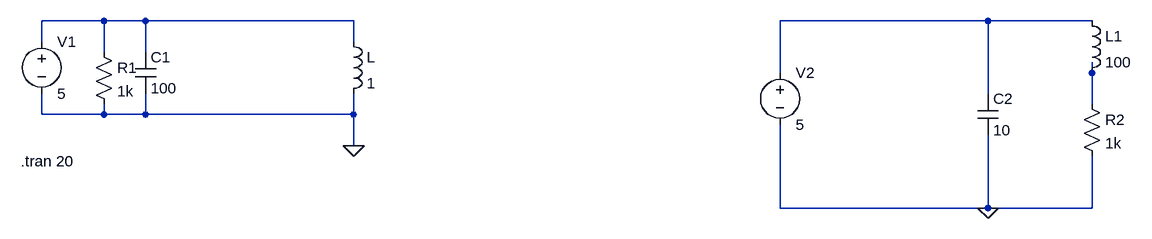
[diagram p0: schematic RCL.asc]
RCL.asc, the LTspice schematic file:
Version 4
SHEET 1 1540 680
WIRE -48 64 -144 64
WIRE 16 64 -48 64
WIRE 336 64 16 64
WIRE 1312 64 992 64
WIRE 1472 64 1312 64
WIRE -144 96 -144 64
WIRE 336 96 336 64
WIRE -48 112 -48 64
WIRE 16 112 16 64
WIRE 992 144 992 64
WIRE 1472 144 1472 128
WIRE 1312 176 1312 64
WIRE 1472 192 1472 144
WIRE -144 208 -144 176
WIRE -48 208 -48 192
WIRE -48 208 -144 208
WIRE 16 208 16 176
WIRE 16 208 -48 208
WIRE 336 208 336 176
WIRE 336 208 16 208
WIRE 336 256 336 208
WIRE 992 352 992 224
WIRE 1312 352 1312 240
WIRE 1312 352 992 352
WIRE 1472 352 1472 272
WIRE 1472 352 1312 352
FLAG 336 256 0
FLAG 1312 352 0
SYMBOL cap 0 112 R0
SYMATTR InstName C1
SYMATTR Value 100
SYMBOL ind 320 80 R0
SYMATTR InstName L
SYMATTR Value 1
SYMBOL res -64 96 R0
SYMATTR InstName R1
SYMATTR Value 1k
SYMBOL voltage -144 80 R0
WINDOW 123 0 0 Left 0
WINDOW 39 0 0 Left 0
SYMATTR InstName V1
SYMATTR Value 5
SYMBOL res 1456 176 R0
SYMATTR InstName R2
SYMATTR Value 1k
SYMBOL voltage 992 128 R0
WINDOW 123 0 0 Left 0
WINDOW 39 0 0 Left 0
SYMATTR InstName V2
SYMATTR Value 5
SYMBOL ind 1456 48 R0
SYMATTR InstName L1
SYMATTR Value 100
SYMBOL cap 1296 176 R0
SYMATTR InstName C2
SYMATTR Value 10
TEXT -176 280 Left 2 !.tran 20

The netlist it stands for:
* RCL.asc
C1 N001 0 100
L N001 0 1
R1 N001 0 1k
V1 N001 0 5
R2 N003 0 1k
V2 N002 0 5
L1 N002 N003 100
C2 N002 0 10
.tran 20
.backanno
.end